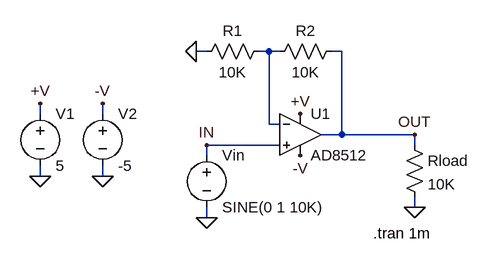
[diagram p0: schematic AD8512.asc]
AD8512.asc, the LTspice schematic file:
Version 4
SHEET 1 1240 700
WIRE 464 -1104 448 -1104
WIRE 560 -1104 544 -1104
WIRE 576 -1104 560 -1104
WIRE 672 -1104 656 -1104
WIRE 208 -1008 208 -1024
WIRE 304 -1008 304 -1024
WIRE 560 -992 560 -1104
WIRE 576 -992 560 -992
WIRE 672 -976 672 -1104
WIRE 672 -976 640 -976
WIRE 784 -976 672 -976
WIRE 576 -960 464 -960
WIRE 784 -960 784 -976
WIRE 464 -944 464 -960
WIRE 208 -912 208 -928
WIRE 304 -912 304 -928
WIRE 784 -864 784 -880
WIRE 464 -848 464 -864
FLAG 208 -1024 +V
FLAG 208 -912 0
FLAG 464 -848 0
FLAG 784 -976 OUT
FLAG 464 -960 IN
FLAG 608 -1008 +V
FLAG 304 -1024 -V
FLAG 608 -944 -V
FLAG 448 -1104 0
FLAG 784 -864 0
FLAG 304 -912 0
SYMBOL Opamps\\AD8512 608 -1040 R0
SYMATTR InstName U1
SYMBOL voltage 208 -1024 R0
WINDOW 123 0 0 Left 2
WINDOW 39 0 0 Left 2
SYMATTR InstName V1
SYMATTR Value 5
SYMBOL voltage 464 -960 R0
WINDOW 123 24 146 Left 2
WINDOW 39 24 125 Left 2
SYMATTR InstName Vin
SYMATTR Value SINE(0 1 10K)
SYMBOL res 560 -1120 R90
WINDOW 0 0 56 VBottom 2
WINDOW 3 32 56 VTop 2
SYMATTR InstName R1
SYMATTR Value 10K
SYMBOL res 672 -1120 R90
WINDOW 0 0 56 VBottom 2
WINDOW 3 32 56 VTop 2
SYMATTR InstName R2
SYMATTR Value 10K
SYMBOL voltage 304 -1024 R0
WINDOW 123 24 146 Left 2
WINDOW 39 24 125 Left 2
SYMATTR InstName V2
SYMATTR Value -5
SYMBOL res 768 -976 R0
SYMATTR InstName Rload
SYMATTR Value 10K
TEXT 720 -824 Left 2 !.tran 1m

The netlist it stands for:
* AD8512.asc
XU1 IN N001 +V -V OUT AD8512  ; pins In+ In- V+ V- OUT
V1 +V 0 5
Vin IN 0 SINE(0 1 10K)
R1 N001 0 10K
R2 OUT N001 10K
V2 -V 0 -5
Rload OUT 0 10K
.tran 1m
.backanno
.end